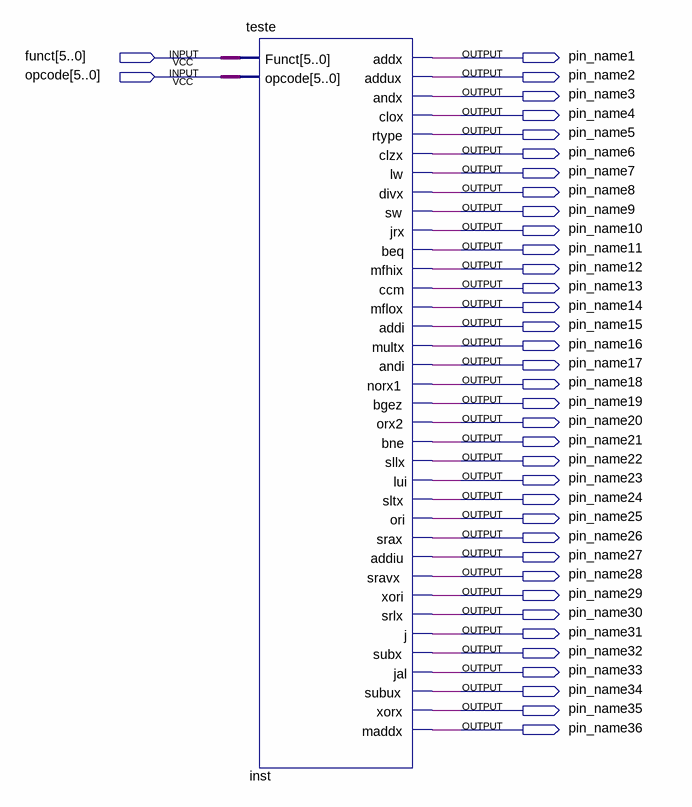
[diagram p0: schematic sheet]
// Quartus schematic inst_dec.bdf as structural Verilog: 1 symbols, 38 pins
module inst_dec (
  input  [5:0] funct,
  input  [5:0] opcode,
  output pin_name1,
  output pin_name2,
  output pin_name3,
  output pin_name4,
  output pin_name5,
  output pin_name6,
  output pin_name7,
  output pin_name8,
  output pin_name9,
  output pin_name10,
  output pin_name11,
  output pin_name12,
  output pin_name13,
  output pin_name14,
  output pin_name15,
  output pin_name16,
  output pin_name17,
  output pin_name18,
  output pin_name19,
  output pin_name20,
  output pin_name21,
  output pin_name22,
  output pin_name23,
  output pin_name24,
  output pin_name25,
  output pin_name26,
  output pin_name27,
  output pin_name28,
  output pin_name29,
  output pin_name30,
  output pin_name31,
  output pin_name32,
  output pin_name33,
  output pin_name34,
  output pin_name35,
  output pin_name36
);

  teste inst (
    .Funct(funct), .opcode(opcode), .addx(pin_name1), .addux(pin_name2), .andx(pin_name3), .clox(pin_name4),
    .rtype(pin_name5), .clzx(pin_name6), .lw(pin_name7), .divx(pin_name8), .sw(pin_name9), .jrx(pin_name10),
    .beq(pin_name11), .mfhix(pin_name12), .ccm(pin_name13), .mflox(pin_name14), .addi(pin_name15),
    .multx(pin_name16), .andi(pin_name17), .norx1(pin_name18), .bgez(pin_name19), .orx2(pin_name20),
    .bne(pin_name21), .sllx(pin_name22), .lui(pin_name23), .sltx(pin_name24), .ori(pin_name25),
    .srax(pin_name26), .addiu(pin_name27), .sravx(pin_name28), .xori(pin_name29), .srlx(pin_name30),
    .j(pin_name31), .subx(pin_name32), .jal(pin_name33), .subux(pin_name34), .xorx(pin_name35),
    .maddx(pin_name36));
endmodule
